# EAGLE design led_module (EAGLE 7.6.0)
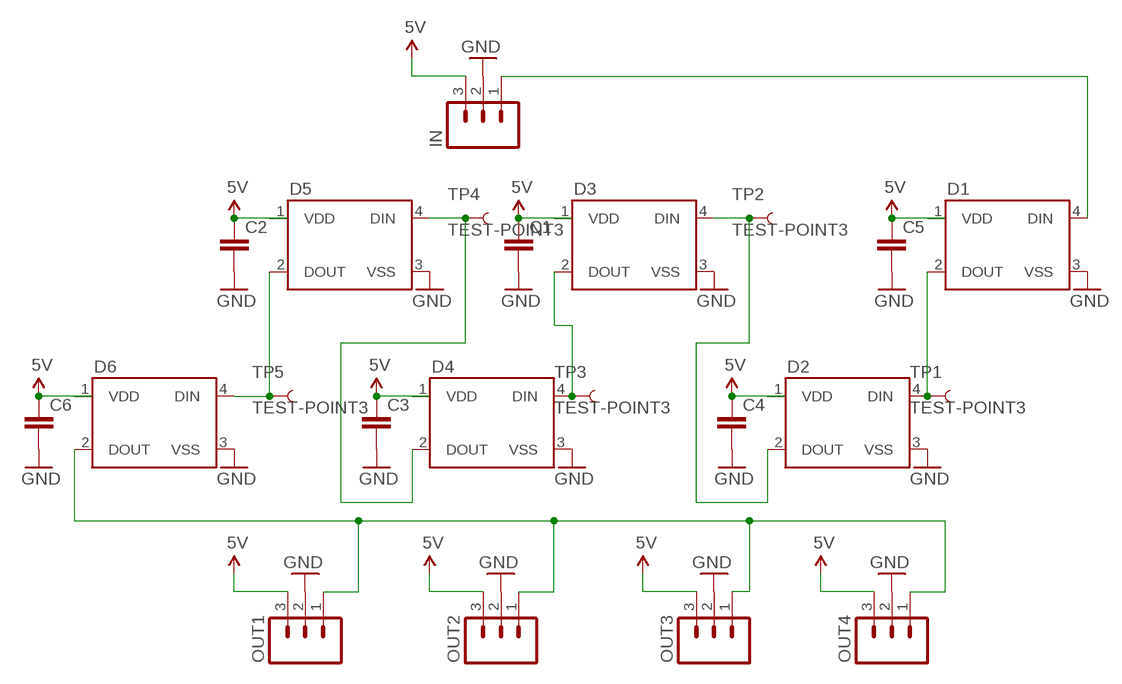
[diagram p0: schematic, sheet 1]

## Parts
C1  CAP0805  [0805]
C2  CAP0805  [0805]
C3  CAP0805  [0805]
C4  CAP0805  [0805]
C5  CAP0805  [0805]
C6  CAP0805  [0805]
D1  WS2812B  [WS2812B]
D2  WS2812B  [WS2812B]
D3  WS2812B  [WS2812B]
D4  WS2812B  [WS2812B]
D5  WS2812B  [WS2812B]
D6  WS2812B  [WS2812B]
IN  M03LONGPADS  [1X03_LONGPADS]
OUT1  M03LONGPADS  [1X03_LONGPADS]
OUT2  M03LONGPADS  [1X03_LONGPADS]
OUT3  M03LONGPADS  [1X03_LONGPADS]
OUT4  M03LONGPADS  [1X03_LONGPADS]
TP1  TEST-POINT3  [PAD.03X.03]
TP2  TEST-POINT3  [PAD.03X.03]
TP3  TEST-POINT3  [PAD.03X.03]
TP4  TEST-POINT3  [PAD.03X.03]
TP5  TEST-POINT3  [PAD.03X.03]

## Nets
5V: C1.1 C2.1 C3.1 C4.1 C5.1 C6.1 D1.1(VDD) D2.1(VDD) D3.1(VDD) D4.1(VDD) D5.1(VDD) D6.1(VDD) IN.3 OUT1.3 OUT2.3 OUT3.3 OUT4.3
GND: C1.2 C2.2 C3.2 C4.2 C5.2 C6.2 D1.3(VSS) D2.3(VSS) D3.3(VSS) D4.3(VSS) D5.3(VSS) D6.3(VSS) IN.2 OUT1.2 OUT2.2 OUT3.2 OUT4.2
N$1: D1.4(DIN) IN.1
N$2: D4.2(DOUT) D5.4(DIN) TP4.P$1
N$3: D5.2(DOUT) D6.4(DIN) TP5.P$1
N$5: D3.2(DOUT) D4.4(DIN) TP3.P$1
N$7: D2.2(DOUT) D3.4(DIN) TP2.P$1
N$8: D6.2(DOUT) OUT1.1 OUT2.1 OUT3.1 OUT4.1
N$9: D1.2(DOUT) D2.4(DIN) TP1.P$1

## Library data of the parts
C1-C6 = SparkFun-Capacitors:CAP: Capacitor Standard 0603 ceramic capacitor, and 0.1" leaded capacitor.
D1-D6 = SparkFun-LED:WS2812B: WS2812B - Intelligent control LED integrated light source Technical Specifications: Power Supply Voltage (VDD): 3.5 to 5.3 V Input Voltage (VI): -0.5 to VDD+0.5 V Operating Junction Temperature (Topt): -25°C to +80°C Storage Temperature Range (Tstg): -55°C to +150°C; PROD_ID: DIO-12503
IN OUT1-OUT4 = SparkFun-Connectors:M03: Header 3 Standard 3-pin 0.1" header. Use with straight break away headers (SKU : PRT-00116), right angle break away headers (PRT-00553), swiss pins (PRT-00743), machine pins (PRT-00117), and female headers (PRT-00115). Molex polarized connector foot print use with SKU : PRT-08232 with associated crimp pins and housings.
TP1-TP5 = SparkFun-Passives:TEST-POINT: Bare copper test points for troubleshooting or ICT

## Net classes
0 default: clearance 0.205 mm

## Board
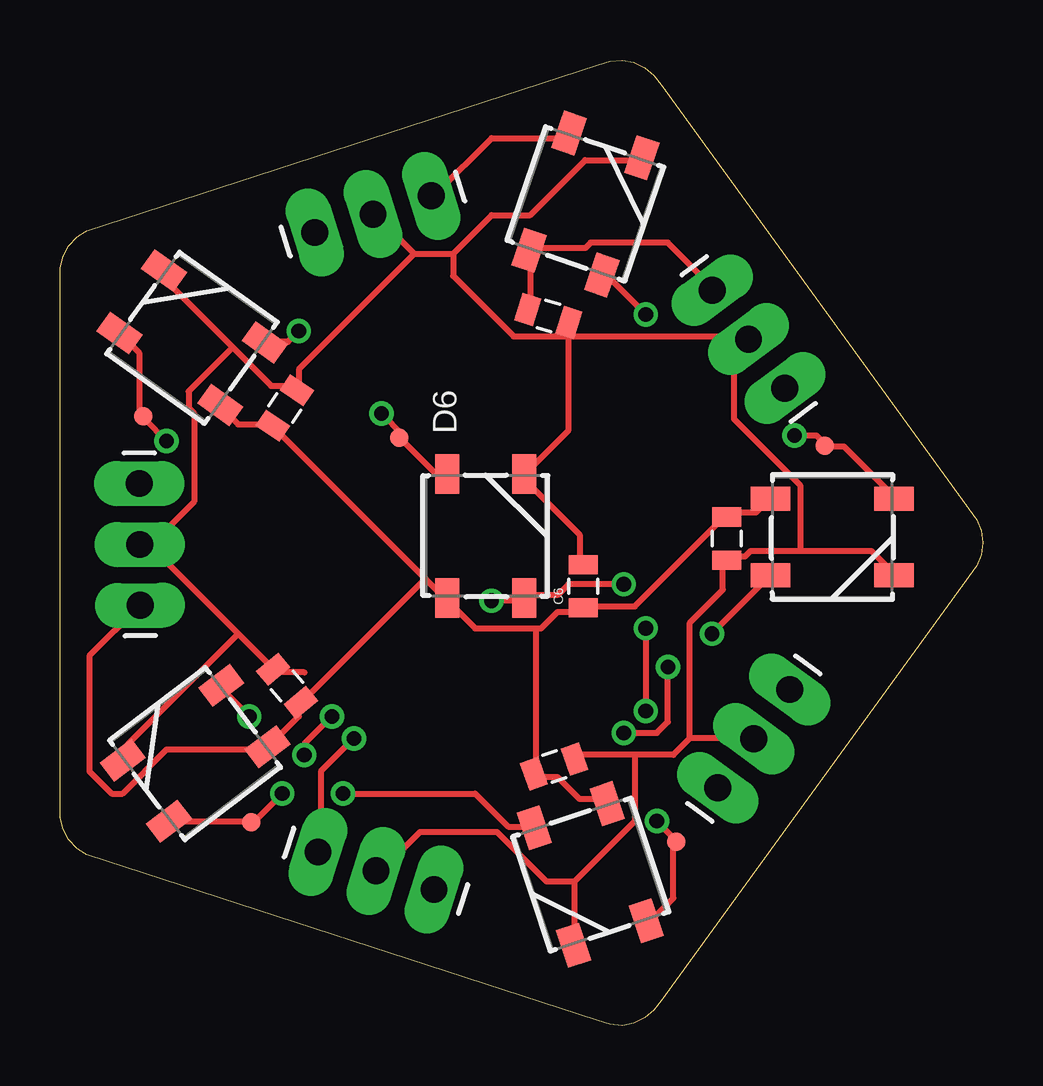
[diagram p1: board, top side]
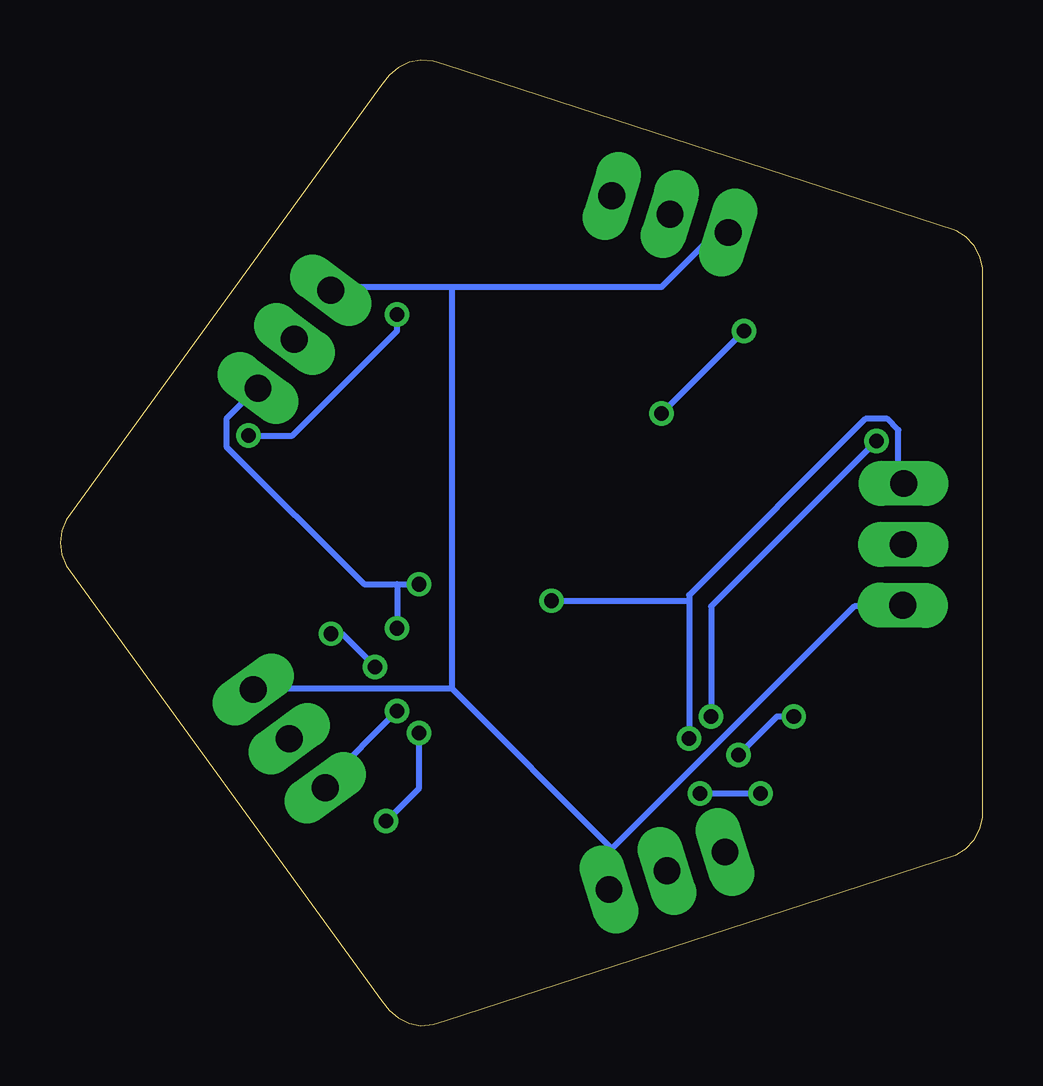
[diagram p2: board, bottom side, seen from below]

Size 38.46 x 40.23 mm. Coordinates in mm from the lower left corner, seen from the top.
Outline: 0,8.66 0,31.57 0.13,32.05 0.36,32.49 0.71,32.87 1.12,33.12 22.43,40.03 22.91,40.18 23.42,40.23 23.9,40.13 24.36,39.9 24.74,39.6 25.04,39.19 38.2,21.08 38.38,20.62 38.46,20.12 38.38,19.61 38.2,19.15 25.04,1.04 24.74,0.63 24.36,0.33 23.9,0.1 23.42,0 22.91,0.05 22.43,0.2 1.12,7.11 0.71,7.37 0.36,7.75 0.13,8.18 0,8.66
Copper layers (1*16): Top 0.035mm / dielectric 1.5mm / Bottom 0.035mm
Design rules "default": minimum track width 10mil, minimum drill 24mil, track to track 8mil, track to pad 8mil, pad to pad 8mil, via to via 8mil, smd to smd 8mil, copper to edge 40mil, drill to drill 8mil, minimum pad ring 10mil, minimum via ring 8mil, stop-mask expansion 4mil, vias tented up to drill 0mil, thermal gap 10mil

### Footprints (pad centres in the part's own frame; a part is rotated, then mirrored left to right if it is on the bottom)
0805 = smd 0.8 x 1.2: 1 -0.9,0; 2 0.9,0
WS2812B = smd 1.651 x 1: 1 -2.577,1.6; 2 -2.577,-1.6; 3 2.577,-1.6; 4 2.577,1.6
1X03_LONGPADS = drill 1.118 pad 1.88 long: 1 0,0; 2 2.54,0; 3 5.08,0
PAD.03X.03 = smd 0.762 x 0.762: P$1 0,0

### Placement (x,y rotation side)
C1  9.37,25.73 56.1 top
C2  9.46,14.16 129.8 top
C3  20.59,10.8 19.7 top
C4  27.77,20.29 270 top
C5  20.35,29.57 342.6 top
C6  21.8,18.31 90 top
D1  21.89,34.23 71.2 top
D2  32.18,20.36 0 top
D3  22.1,6.3 288.4 top
D4  5.63,11.34 217.2 top
D5  5.51,28.66 144.5 top
D6  17.74,20.4 90 top
IN  15.46,34.57 197.5 top
OUT1  30.2,26.56 126.6 top
OUT2  27.41,9.91 53.8 top
OUT3  10.75,7.23 342.1 top
OUT4  3.3,22.59 270.4 top
TP1  31.87,24.17 0 top
TP2  25.67,7.67 0 top
TP3  7.97,8.47 0 top
TP4  3.47,25.39 0 top
TP5  14.14,24.48 0 top

### Tracks (layer width: path | path; a pad name or v marks a point on that pad's centre or on a via)
5V
  Top 0.254: D3.1 22.57,9.44 21.65,9.44 20.74,10.36 19.82,10.36 C3.1 19.82,10.59 19.82,16.55 | D2.1 29.46,21.83 29,21.37 27.85,21.37 C4.1 27.62,21.14 23.95,17.47 21.88,17.47 C6.1 21.65,17.24 20.74,17.24 20.05,16.55 19.82,16.55 | D5.1 6.74,25.73 7.42,25.05 8.8,25.05 C1.1 9.03,24.82 15.23,18.62 | 19.82,16.55 17.29,16.55 16.15,17.7 D6.1 15.92,17.93 15.23,18.62 | 15.23,18.62 10.18,13.57 C2.1 9.95,13.34 9.95,12.88 8.8,11.73 D4.1 8.57,11.51 4.44,11.51 2.61,9.67 2.15,9.67 1.23,10.59 1.23,15.41 3.29,17.47 OUT4.3 | C5.1 19.59,29.87 19.59,32.16 D1.1 19.59,32.39 21.88,32.39 22.11,32.62 25.33,32.62 27.16,30.78 OUT1.3
  Bottom 0.254: 22.11,30.78 27.16,30.78 OUT1.3 | 22.11,30.78 13.39,30.78 11.33,32.85 10.64,32.85 IN.3 | 15.46,7.37 15.46,5.77 OUT3.3 15.46,7.37 | 15.46,7.37 5.36,17.47 3.52,17.47 OUT4.3 | 22.11,14.03 30.38,14.03 OUT2.3 | 15.46,7.37 22.11,14.03 | 22.11,14.03 22.11,30.78
GND
  Top 0.254: 21.42,29.41 C5.2 | 10.18,14.72 9.03,14.72 C2.2 8.8,14.95 7.42,16.33 | 30.83,19.77 33.82,19.77 34.73,18.85 D2.3 | 30.83,19.77 28.77,19.77 28.54,19.54 27.85,19.54 C4.2 27.62,19.31 27.62,18.16 26.24,16.78 26.24,11.96 | 23.95,11.28 25.55,11.28 26.24,11.96 | 23.95,11.28 21.65,11.28 C3.2 | 26.24,11.96 28.77,11.96 OUT2.2 | 21.42,6 21.42,3.47 D3.3 | 21.42,6 23.95,8.52 23.95,11.28 | 21.42,6 20.28,6 18.21,8.06 15,8.06 13.39,6.46 OUT3.2 | C6.2 21.65,19.31 21.65,20.46 19.36,22.75 D6.3 19.36,22.98 21.2,24.82 21.2,28.72 | 21.2,28.72 21.2,29.18 C5.2 | 21.2,28.72 28.08,28.72 | 28.08,28.72 28.54,28.72 OUT1.2 28.08,28.72 | 3.75,20 3.52,20.23 OUT4.2 3.75,20 | 3.75,20 7.42,16.33 | 7.42,16.33 2.83,11.73 2.83,11.28 D4.3 | 7.2,28.26 4.21,31.24 D5.3 | 7.2,28.26 8.8,26.65 9.72,26.65 C1.2 9.95,26.65 9.95,27.34 14.77,32.16 | 16.38,32.16 17.98,33.77 19.59,33.77 21.88,36.06 24.18,36.06 D1.3 | 14.77,32.16 16.38,32.16 | 14.77,32.16 13.16,33.77 IN.2 | 3.75,20 5.59,21.83 5.59,25.51 5.36,25.73 5.36,26.42 7.2,28.26 | 21.2,28.72 18.9,28.72 16.38,31.24 16.38,32.16 | 21.2,28.72 C5.2 | 30.83,19.77 30.83,22.52 28.08,25.28 28.08,28.72
N$1
  Top 0.254: D1.4 21.2,36.98 17.98,36.98 15.69,34.69 IN.1
N$2  (via drill 0.61)
  Top 0.254: D5.4 2.61,28.72 3.29,28.03 3.29,25.51 TP4.P$1 3.52,25.28 v4.44,24.36 | v7.88,12.88 6.74,14.03 D4.2 | v10.18,11.28 10.18,11.73 v11.33,12.88
  Bottom 0.254: v7.88,12.88 8.57,12.88 v10.18,11.28 | v11.33,12.88 11.33,17.47 v4.44,24.36
N$3  (via drill 0.61)
  Top 0.254: D6.4 15.92,22.75 14.31,24.36 TP5.P$1 14.31,24.59 v13.39,25.51 | v9.95,28.95 9.49,28.49 8.57,28.49 D5.2
  Bottom 0.254: v13.39,25.51 v9.95,28.95
N$5  (via drill 0.61)
  Top 0.254: D4.4 4.67,8.52 7.88,8.52 TP3.P$1 8.11,8.52 v9.26,9.67 | v11.79,9.67 17.29,9.67 18.67,8.29 19.59,8.29 D3.2
  Bottom 0.254: v9.26,9.67 v11.79,9.67
N$7  (via drill 0.61)
  Top 0.254: D3.4 24.64,4.39 25.55,5.31 25.55,7.6 TP2.P$1 25.55,7.83 v24.87,8.52 | v27.16,16.33 29.46,18.62 D2.2 | v25.33,14.95 25.33,12.65 24.87,12.19 v23.49,12.19
  Bottom 0.254: v27.16,16.33 26.7,16.33 v25.33,14.95 | v23.49,12.19 23.49,9.9 v24.87,8.52
N$8  (via drill 0.61)
  Top 0.254: v12.24,11.96 10.87,10.59 10.87,7.37 OUT3.1 | v23.49,18.39 21.2,18.39 20.74,17.93 19.36,17.93 D6.2 19.13,17.7 v17.98,17.7 | v24.41,16.55 v24.41,13.11
  Bottom 0.254: 12.24,17.7 12.24,17.93 4.9,25.28 3.98,25.28 3.52,24.82 3.52,22.75 OUT4.1 | 12.24,17.7 v12.24,11.96 | 24.41,18.39 25.79,18.39 31.52,24.13 31.52,25.28 30.38,26.42 OUT1.1 | 24.41,18.39 v23.49,18.39 | v24.41,13.11 27.39,10.13 OUT2.1 | 24.41,18.39 v24.41,16.55 | v17.98,17.7 12.24,17.7
N$9  (via drill 0.61)
  Top 0.254: D2.4 34.73,22.06 32.67,24.13 31.98,24.13 TP1.P$1 31.75,24.36 31.52,24.59 v30.6,24.59 | v24.41,29.64 22.8,31.24 D1.2
  Bottom 0.254: v24.41,29.64 24.41,28.95 28.77,24.59 v30.6,24.59